# Altium project masslink.PrjPcb
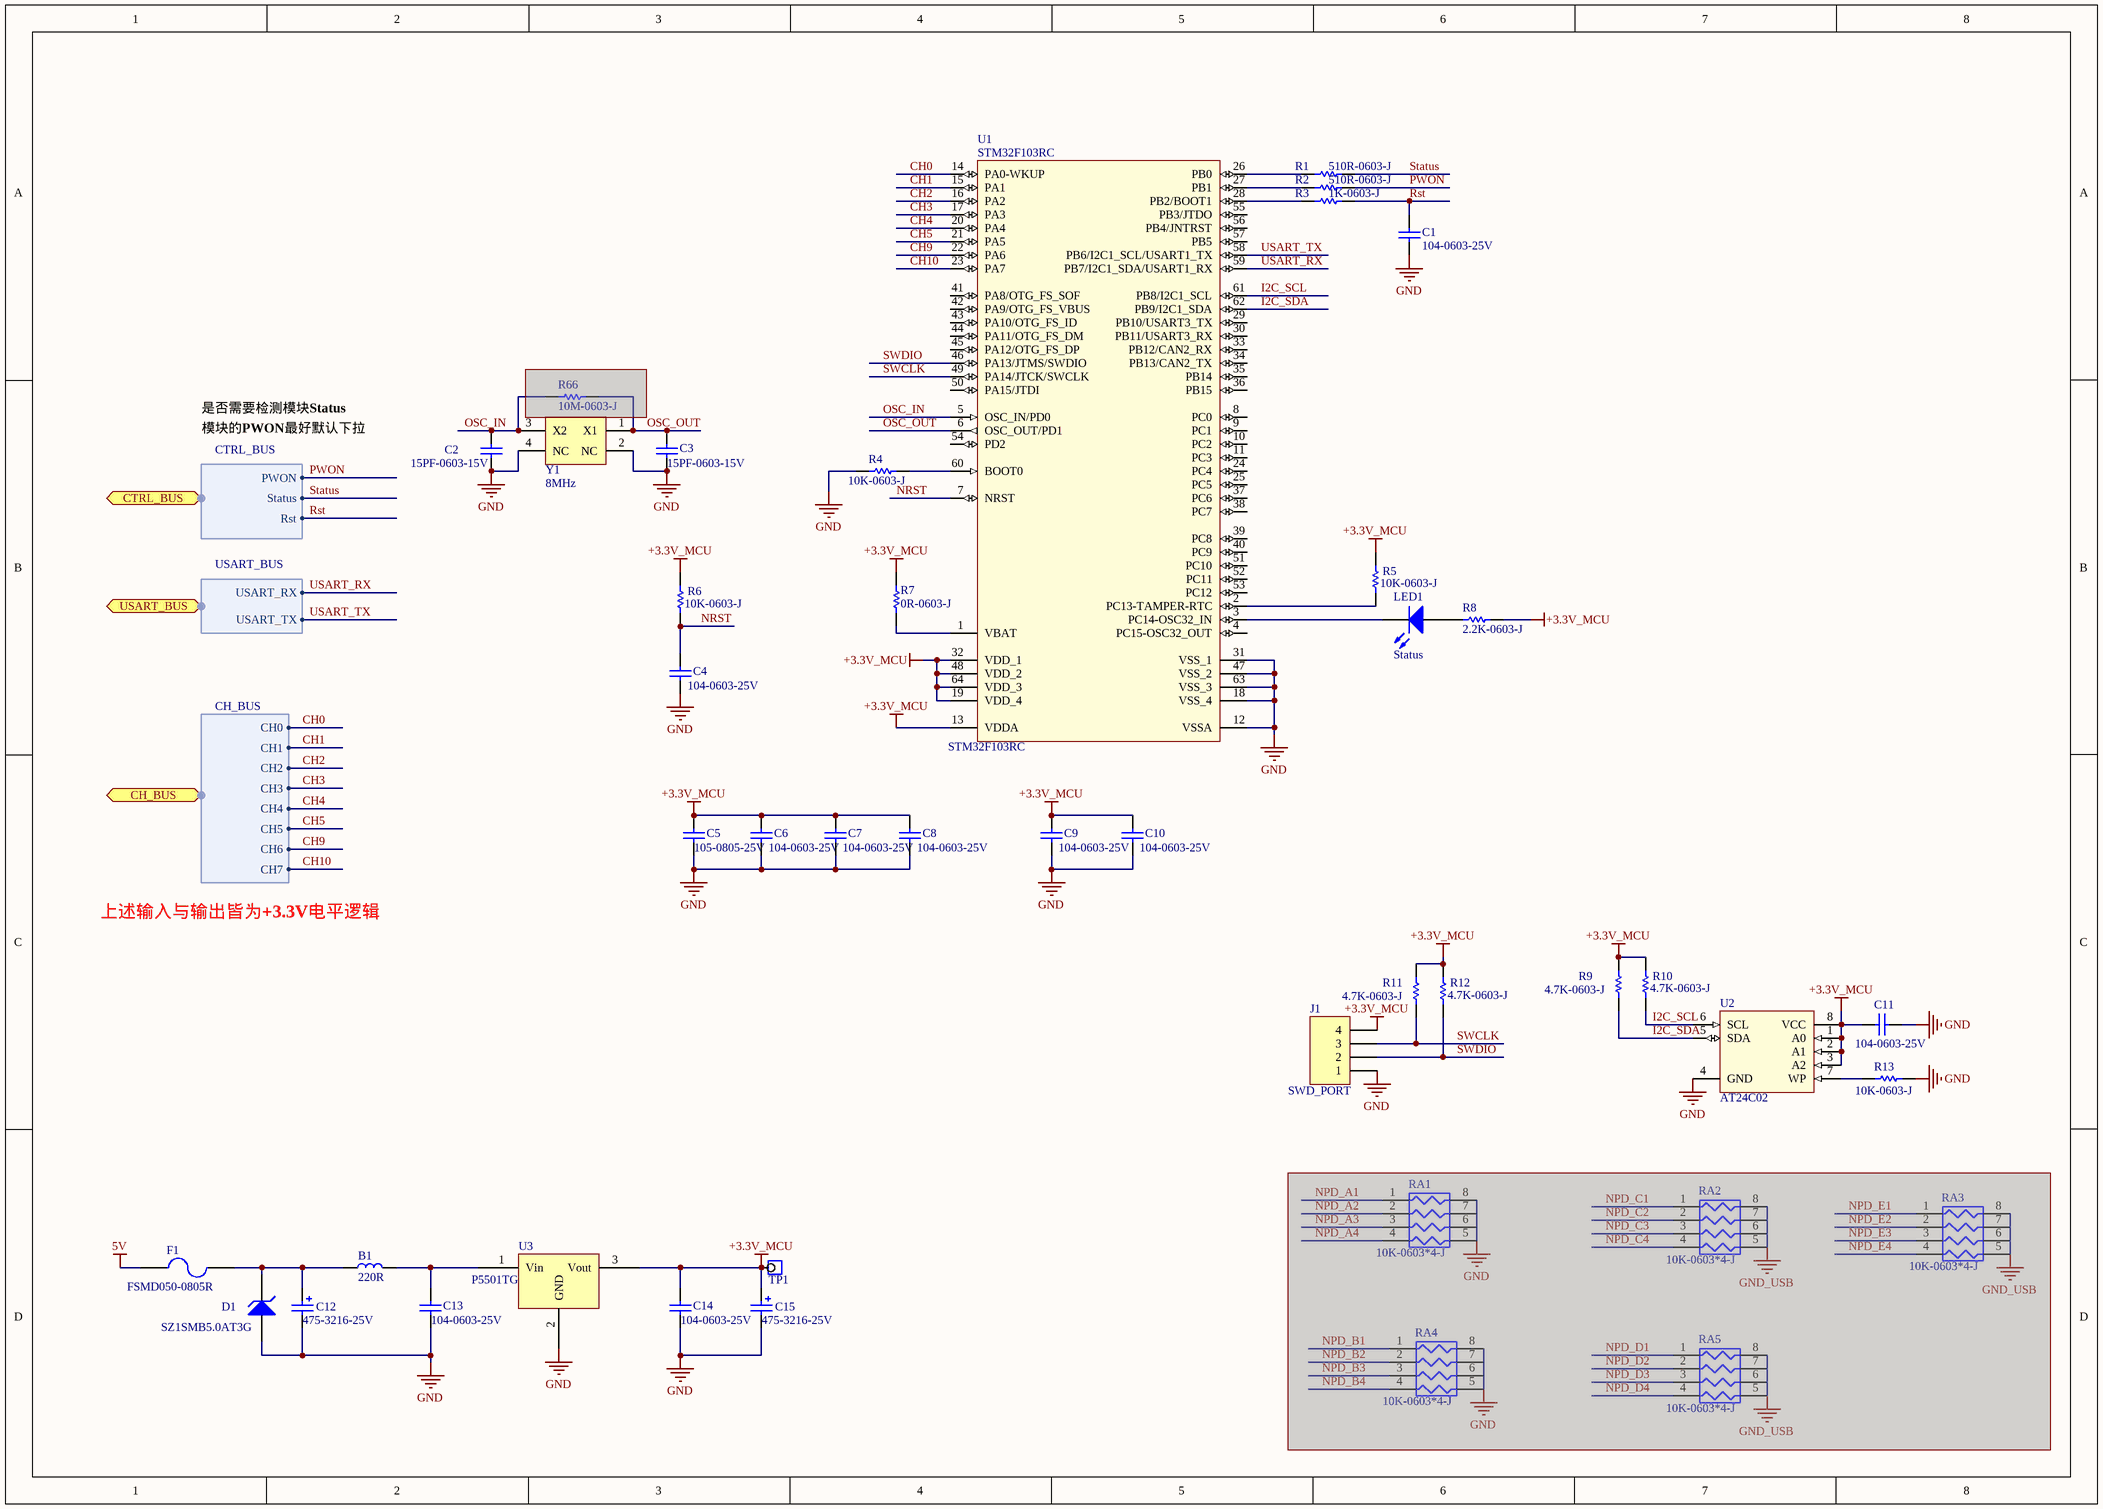
[diagram p0: MCU.SchDoc]
1 sheet, 44 parts. Net scope: flat (ports and power ports of the same name join across sheets).
Board file: masslink.PcbDoc

## Sheet MCU.SchDoc: MASSLINK
size A3; Date: 2018.06.04; Revision: V01.00.00; SheetNumber: 1; SheetTotal: 1

### Parts
B1  220R  [RCL0805TH]
C1  104-0603-25V  [RCC0603TH]
C2  15PF-0603-15V  [RCC0603TH]
C3  15PF-0603-15V  [RCC0603TH]
C4  104-0603-25V  [RCC0603TH]
C5  105-0805-25V  [RCC0805TH]
C6  104-0603-25V  [RCC0603TH]
C7  104-0603-25V  [RCC0603TH]
C8  104-0603-25V  [RCC0603TH]
C9  104-0603-25V  [RCC0603TH]
C10  104-0603-25V  [RCC0603TH]
C11  104-0603-25V  [RCC0603TH]
C12  475-3216-25V  [RCCT-3216B]
C13  104-0603-25V  [RCC0603TH]
C14  104-0603-25V  [RCC0603TH]
C15  475-3216-25V  [RCCT-3216B]
D1  SZ1SMB5.0AT3G  [RCD-SMBTH]
F1  FSMD050-0805R  [RCC0805TH]
J1  SWD_PORT  [RCJ1.5-4CA]
LED1  Status  [RCD-LED0805TH]
R1  510R-0603-J  [RCR0603TH]
R2  510R-0603-J  [RCR0603TH]
R3  1K-0603-J  [RCR0603TH]
R4  10K-0603-J  [RCR0603TH]
R5  10K-0603-J  [RCR0603TH]
R6  10K-0603-J  [RCR0603TH]
R7  0R-0603-J  [RCR0603TH]
R8  2.2K-0603-J  [RCR0603TH]
R9  4.7K-0603-J  [RCR0603TH]
R10  4.7K-0603-J  [RCR0603TH]
R11  4.7K-0603-J  [RCR0603TH]
R12  4.7K-0603-J  [RCR0603TH]
R13  10K-0603-J  [RCR0603TH]
R66  10M-0603-J  [RCR0603TH]  (masked out: inside a compile mask, not in the netlist)
RA1  10K-0603*4-J  [RCR0603X4BTH]  (masked out: inside a compile mask, not in the netlist)
RA2  10K-0603*4-J  [RCR0603X4BTH]  (masked out: inside a compile mask, not in the netlist)
RA3  10K-0603*4-J  [RCR0603X4BTH]  (masked out: inside a compile mask, not in the netlist)
RA4  10K-0603*4-J  [RCR0603X4BTH]  (masked out: inside a compile mask, not in the netlist)
RA5  10K-0603*4-J  [RCR0603X4BTH]  (masked out: inside a compile mask, not in the netlist)
TP1  Test Point  [RCTOOL-TPB]  (value not drawn)
U1  STM32F103RC  [RCIC-LQFP-64B]
U2  AT24C02  [RCIC-SOIC8]
U3  P5501TG  [RCQ-DPAK]
Y1  8MHz  [RCJT-5X3THB]

### Ports
CH_BUS (harness CH_BUS), CTRL_BUS (harness CTRL_BUS), USART_BUS (harness USART_BUS)

### Harnesses
USART_BUS: USART_RX, USART_TX
CH_BUS: CH0, CH1, CH2, CH3, CH4, CH5, CH6, CH7
CTRL_BUS: PWON, Status, Rst

### Nets
5V: F1.1
+3.3V_MCU: C5.1 C6.2 C7.2 C8.2 C9.2 C10.2 C11.2 C14.1 C15.1 J1.4 R5.2 R6.2 R7.1 R8.2 R9.2 R10.2 R11.2 R12.2 TP1.1 U1.13(VDDA) U1.19(VDD_4) U1.32(VDD_1) U1.48(VDD_2) U1.64(VDD_3) U2.1(A0) U2.2(A1) U2.3(A2) U2.8(VCC) U3.3(Vout)
GND: C1.2 C2.1 C3.2 C4.1 C5.2 C6.1 C7.1 C8.1 C9.1 C10.1 C11.1 C12.2 C13.2 C14.2 C15.2 D1.1(A) J1.1 R4.2 R13.1 U1.12(VSSA) U1.18(VSS_4) U1.31(VSS_1) U1.47(VSS_2) U1.63(VSS_3) U2.4(GND) U3.2(GND) Y1.2(NC) Y1.4(NC)
CH0: U1.14(PA0-WKUP) ; port CH_BUS.CH0
CH1: U1.15(PA1) ; port CH_BUS.CH1
CH2: U1.16(PA2) ; port CH_BUS.CH2
CH3: U1.17(PA3) ; port CH_BUS.CH3
CH4: U1.20(PA4) ; port CH_BUS.CH4
CH5: U1.21(PA5) ; port CH_BUS.CH5
CH9: U1.22(PA6) ; port CH_BUS.CH6
CH10: U1.23(PA7) ; port CH_BUS.CH7
I2C_SCL: R10.1 U1.61(PB8/I2C1_SCL) U2.6(SCL)
I2C_SDA: R9.1 U1.62(PB9/I2C1_SDA) U2.5(SDA)
NRST: C4.2 R6.1 U1.7(NRST)
OSC_IN: C2.2 U1.5(OSC_IN/PD0) Y1.3(X2)
OSC_OUT: C3.1 U1.6(OSC_OUT/PD1) Y1.1(X1)
PWON: R2.1 ; port CTRL_BUS.PWON
Rst: C1.1 R3.1 ; port CTRL_BUS.Rst
Status: R1.1 ; port CTRL_BUS.Status
SWCLK: J1.3 R11.1 U1.49(PA14/JTCK/SWCLK)
SWDIO: J1.2 R12.1 U1.46(PA13/JTMS/SWDIO)
USART_RX: U1.59(PB7/I2C1_SDA/USART1_RX) ; port USART_BUS.USART_RX
USART_TX: U1.58(PB6/I2C1_SCL/USART1_TX) ; port USART_BUS.USART_TX
NetB1_1: B1.1 C12.1 D1.2(K) F1.2
NetB1_2: B1.2 C13.1 U3.1(Vin)
NetLED1_1: LED1.1(A) R8.1
NetLED1_2: LED1.2(K) U1.3(PC14-OSC32_IN)
NetR1_2: R1.2 U1.26(PB0)
NetR2_2: R2.2 U1.27(PB1)
NetR3_2: R3.2 U1.28(PB2/BOOT1)
NetR4_1: R4.1 U1.60(BOOT0)
NetR5_1: R5.1 U1.2(PC13-TAMPER-RTC)
NetR7_2: R7.2 U1.1(VBAT)
NetR13_2: R13.2 U2.7(WP)

Not connected (* = marked no-connect by the designer): U1 4(PC15-OSC32_OUT) 8(PC0) 9(PC1) 10(PC2) 11(PC3) 24(PC4) 25(PC5) 29(PB10/USART3_TX) 30(PB11/USART3_RX) 33(PB12/CAN2_RX) 34(PB13/CAN2_TX) 35(PB14) 36(PB15) 37(PC6) 38(PC7) 39(PC8) 40(PC9) 41(PA8/OTG_FS_SOF) 42(PA9/OTG_FS_VBUS) 43(PA10/OTG_FS_ID) 44(PA11/OTG_FS_DM) 45(PA12/OTG_FS_DP) 50(PA15/JTDI) 51(PC10) 52(PC11) 53(PC12) 54(PD2) 55(PB3/JTDO) 56(PB4/JNTRST) 57(PB5)

### Notes on the sheet
- 是否需要检测模块Status
- 模块的PWON最好默认下拉
- 上述输入与输出皆为+3.3V电平逻辑

### Library data of the parts
B1 = Bead: Bead,1400mA; Ordering: BLM21PG221SN1; Comments: 220R; Libnum: *; Manufacture: *
C1-C11 C13 C14 = Cap_Nonpolar: 无极性电容; Libnum: *; Manufacture: *; Odering: *
  C1 C4 C6-C11 C13 C14: Comments: 104-0603-25V
  C2 C3: Comments: 15PF-0603-15V
  C5: Comments: 105-0805-25V
C12 C15 = Cap_polar: 有极性电容; Comments: 475-3216-25V; Libnum: *; Manufacture: *; Ordering: *
D1 = DiodeA: Zener,Tvs; Comments: SZ1SMB5.0AT3G; Libnum: *; Manufacture: *; Ordering: SZ1SMB5.0AT3G
F1 = FUSE: Manufacture: LittleFuse; Comments: FSMD050-0805R; Libnum: *; Ordering: FSMD050-0805R
LED1 = LEDA: Comments: Status; Libnum: *; Manufacture: *; Odering: *
R1-R13 R66 = RES_AMERICAN: 电阻 美式; Libnum: *; Manufacture: *; Ordering: *
  R1 R2: Comments: 510R-0603-J
  R3: Comments: 1K-0603-J
  R4-R6 R13: Comments: 10K-0603-J
  R7: Comments: 0R-0603-J
  R8: Comments: 2.2K-0603-J
  R9-R12: Comments: 4.7K-0603-J
  R66: Comments: 10M-0603-J
RA1-RA5 = ResArray: Comments: 10K-0603*4-J; Libnum: *; Manufacture: *; Ordering: *
TP1 = TP Point
U1 = STM32F10XR8: ST Cortex M3 32bits MCU; Libnum: *; Manufacture: ST; Odering: *; Comments: STM32F103RC
U2 = AT24C0X: Comments: AT24C02; Libnum: *; Manufacture: *; Ordering: *
U3 = P5501: Ordering: NCV5501DT33G; Comments: P5501TG; Libnum: *; Manufacture: *
Y1 = Crystal_B: Comments: 8MHz; Libnum: *; Manufacture: *; Odering: *
J1 = SWD_PORT: Comments: SWD_PORT; Libnum: *; Manufacture: *; Odering: *